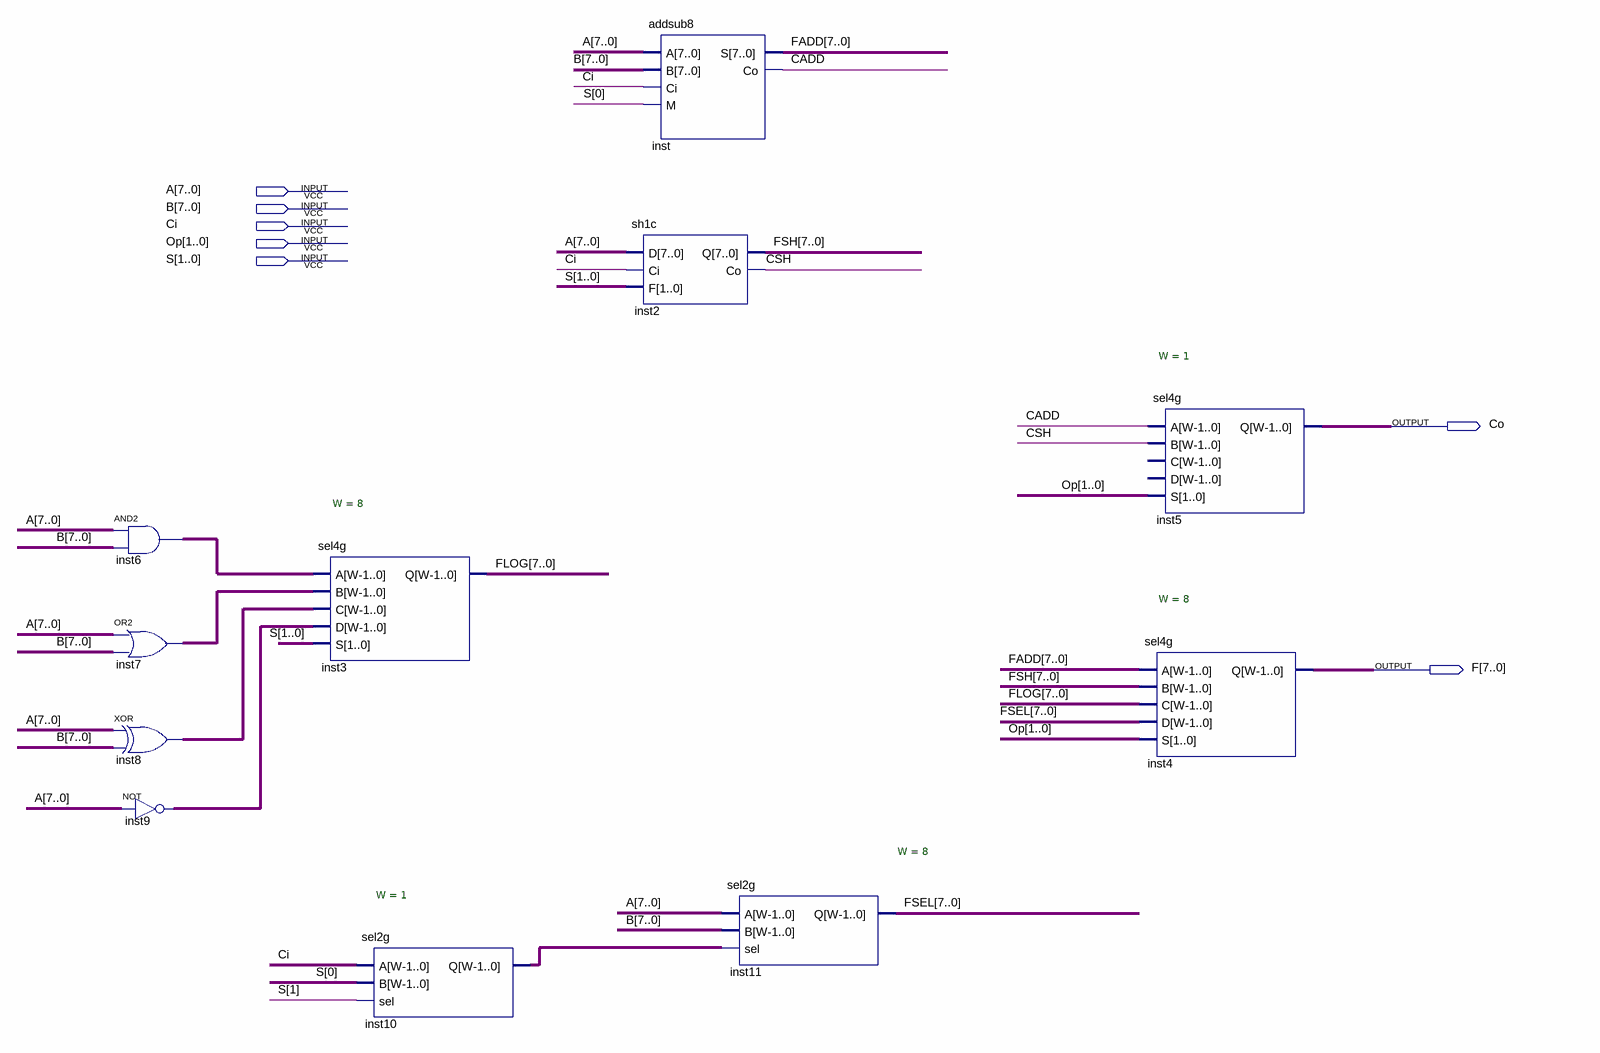
[diagram p0: schematic sheet]
// Quartus schematic arch.bdf as structural Verilog: 11 symbols, 7 pins
module arch (
  input  [7:0] A,
  input  [7:0] B,
  input  Ci,
  input  [1:0] Op,
  input  [1:0] S,
  output Co,
  output [7:0] F
);

  wire CADD, CSH, inst10_q;
  wire [7:0] FADD, FLOG, FSEL, FSH, inst6_out, inst7_out, inst8_out, inst9_out;

  assign inst6_out = A & B;  // AND2 inst6, 8 bits wide
  assign inst7_out = A | B;  // OR2 inst7, 8 bits wide
  assign inst8_out = A ^ B;  // XOR inst8, 8 bits wide
  assign inst9_out = ~A;  // NOT inst9, 8 bits wide
  sel4g #(.W(8)) inst3 (.A(inst6_out), .B(inst7_out), .C(inst8_out), .D(inst9_out), .S(S), .Q(FLOG));
  sel2g #(.W(1)) inst10 (.A(Ci), .B(S[0]), .sel(S[1]), .Q(inst10_q));
  sh1c inst2 (.D(A), .Ci(Ci), .F(S), .Q(FSH), .Co(CSH));
  addsub8 inst (.A(A), .B(B), .Ci(Ci), .M(S[0]), .S(FADD), .Co(CADD));
  sel2g #(.W(8)) inst11 (.A(A), .B(B), .sel(inst10_q), .Q(FSEL));
  sel4g #(.W(1)) inst5 (.A(CADD), .B(CSH), .S(Op), .Q(Co));  // open: C, D
  sel4g #(.W(8)) inst4 (.A(FADD), .B(FSH), .C(FLOG), .D(FSEL), .S(Op), .Q(F));
endmodule
